# Altium schematic sheet MainSch.SchDoc
size A
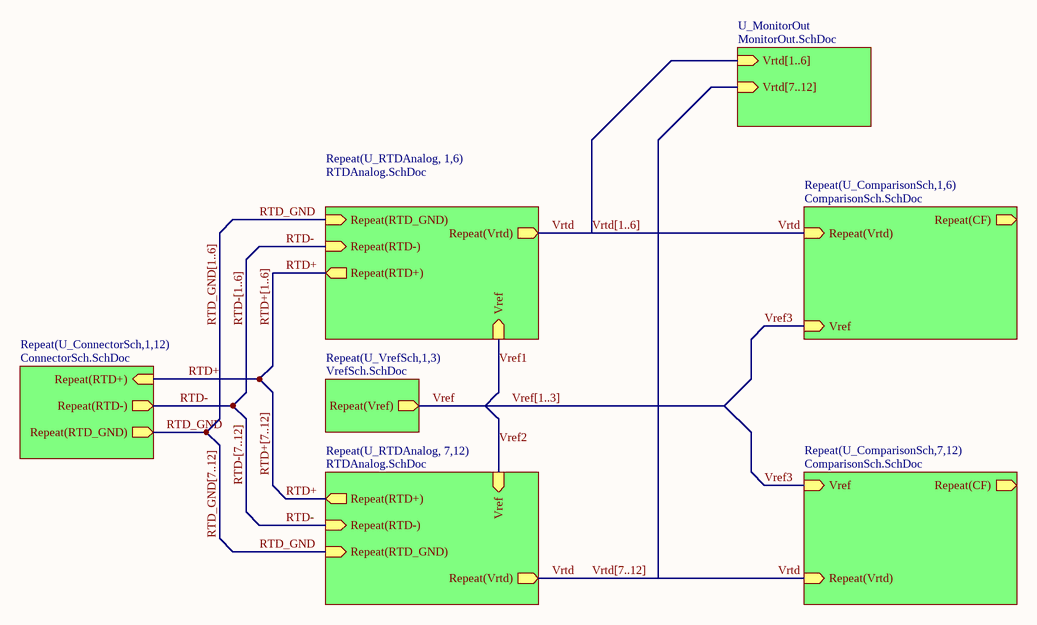
[diagram p0: MainSch.SchDoc]

## Sub-sheets
Repeat(U_ComparisonSch,1,6) = ComparisonSch.SchDoc: Vref (in), Repeat(Vrtd) (in), Repeat(CF) (out)
Repeat(U_ComparisonSch,7,12) = ComparisonSch.SchDoc: Vref (in), Repeat(Vrtd) (in), Repeat(CF) (out)
Repeat(U_ConnectorSch,1,12) = ConnectorSch.SchDoc: Repeat(RTD+) (in), Repeat(RTD-) (out), Repeat(RTD_GND) (out)
Repeat(U_RTDAnalog, 1,6) = RTDAnalog.SchDoc: Repeat(RTD+) (out), Vref (in), Repeat(RTD_GND) (in), Repeat(Vrtd) (out), Repeat(RTD-) (in)
Repeat(U_RTDAnalog, 7,12) = RTDAnalog.SchDoc: Repeat(RTD+) (out), Vref (in), Repeat(RTD_GND) (in), Repeat(Vrtd) (out), Repeat(RTD-) (in)
Repeat(U_VrefSch,1,3) = VrefSch.SchDoc: Repeat(Vref) (out)
U_MonitorOut = MonitorOut.SchDoc: Vrtd[1..6] (in), Vrtd[7..12] (in)

## Nets
RTD+: sheet Repeat(U_RTDAnalog, 1,6)/Repeat(RTD+), sheet Repeat(U_RTDAnalog, 7,12)/Repeat(RTD+), sheet Repeat(U_ConnectorSch,1,12)/Repeat(RTD+)
RTD-: sheet Repeat(U_RTDAnalog, 1,6)/Repeat(RTD-), sheet Repeat(U_RTDAnalog, 7,12)/Repeat(RTD-), sheet Repeat(U_ConnectorSch,1,12)/Repeat(RTD-)
RTD_GND: sheet Repeat(U_RTDAnalog, 1,6)/Repeat(RTD_GND), sheet Repeat(U_RTDAnalog, 7,12)/Repeat(RTD_GND), sheet Repeat(U_ConnectorSch,1,12)/Repeat(RTD_GND)  [also labelled RTD_GND[7..12]]
Vref: sheet Repeat(U_VrefSch,1,3)/Repeat(Vref)
Vref1: sheet Repeat(U_RTDAnalog, 1,6)/Vref
Vref2: sheet Repeat(U_RTDAnalog, 7,12)/Vref
Vref3: sheet Repeat(U_ComparisonSch,1,6)/Vref, sheet Repeat(U_ComparisonSch,7,12)/Vref
Vrtd: sheet Repeat(U_RTDAnalog, 1,6)/Repeat(Vrtd), sheet Repeat(U_RTDAnalog, 7,12)/Repeat(Vrtd), sheet Repeat(U_ComparisonSch,1,6)/Repeat(Vrtd), sheet Repeat(U_ComparisonSch,7,12)/Repeat(Vrtd)

## Buses and harness runs
bus RTD+[1..6]
bus RTD+[7..12]
bus RTD-[1..6]
bus RTD-[7..12]
bus RTD_GND[1..6]
bus Vref[1..3]
bus Vrtd[1..6] = sheet U_MonitorOut/Vrtd[1..6]
bus Vrtd[7..12] = sheet U_MonitorOut/Vrtd[7..12]